# EAGLE design ACC_SensorBoard (EAGLE 7.2.0)
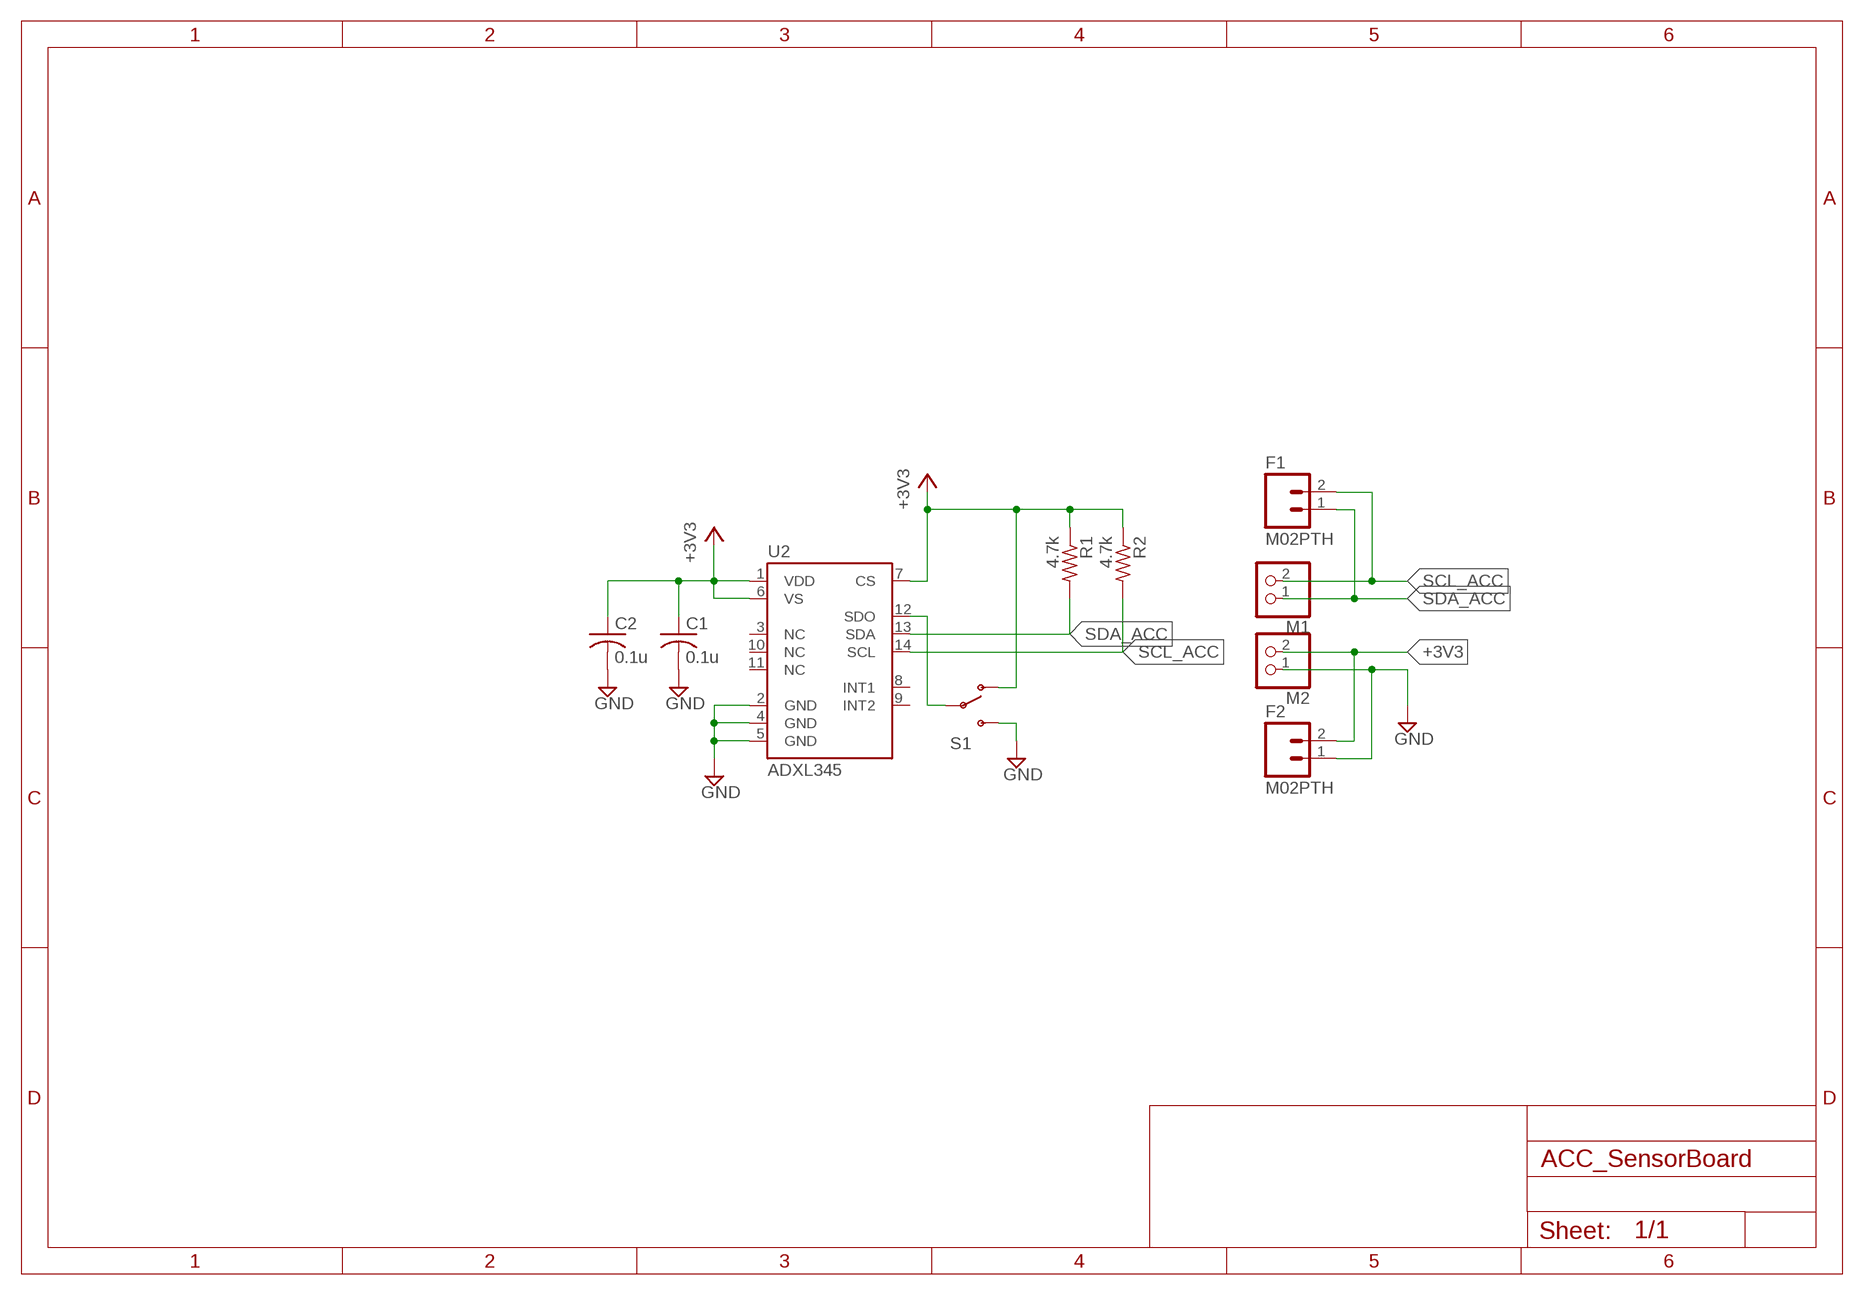
[diagram p0: schematic, sheet 1]

## Parts
C1  0.1u  C-USC0805  [C0805]
C2  0.1u  C-USC0805  [C0805]
F1  M02PTH  [1X02]
F2  M02PTH  [1X02]
M1  PINHD-1X2  [1X02]
M2  PINHD-1X2  [1X02]
R1  4.7k  R-US_R0805  [R0805]
R2  4.7k  R-US_R0805  [R0805]
S1  SWITCH-SPDTSMD  [AYZ0202]
U2  ADXL345  [LGA14]

## Nets
+3V3: C1.1 C2.1 F2.2 M2.2 R1.1 R2.1 S1.1(O) U2.1(VDD) U2.6(VS) U2.7(CS)
GND: C1.2 C2.2 F2.1 M2.1 S1.3(S) U2.2(GND) U2.4(GND) U2.5(GND)
N$1: S1.2(P) U2.12(SDO)
SCL_ACC: F1.2 M1.2 R2.2 U2.14(SCL)
SDA_ACC: F1.1 M1.1 R1.2 U2.13(SDA)
Unconnected: U2.3(NC) U2.8(INT1) U2.9(INT2) U2.10(NC) U2.11(NC)

## Library data of the parts
C1 C2 = rcl:C-US: CAPACITOR, American symbol
F1 F2 = SparkFun-Connectors:M02: Standard 2-pin 0.1" header. Use with - straight break away headers ( PRT-00116) - right angle break away headers (PRT-00553) - swiss pins (PRT-00743) - machine pins (PRT-00117) - female headers (PRT-00115) Molex polarized connector foot print use with: PRT-08233 with associated crimp pins and housings. 2.54_SCREWTERM for use with PRT-10571. 3.5mm Screw Terminal footprints for PRT-08084 5mm Screw Terminal footprints for use with PRT-08432
M1 M2 = pinhead:PINHD-1X2: PIN HEADER
R1 R2 = rcl:R-US_: RESISTOR, American symbol
S1 = SparkFun-Electromechanical:SWITCH-SPDT: SPDT Switch Simple slide switch, Spark Fun Electronics SKU : COM-00102 DPDT SMT slide switch, AYZ0202, SWCH-08179; PROD_ID: SWCH-08179
U2 = SparkFun-Sensors:ADXL345: 3-axis SPI/I2C 2/4/8/16g accelerometer

## Board
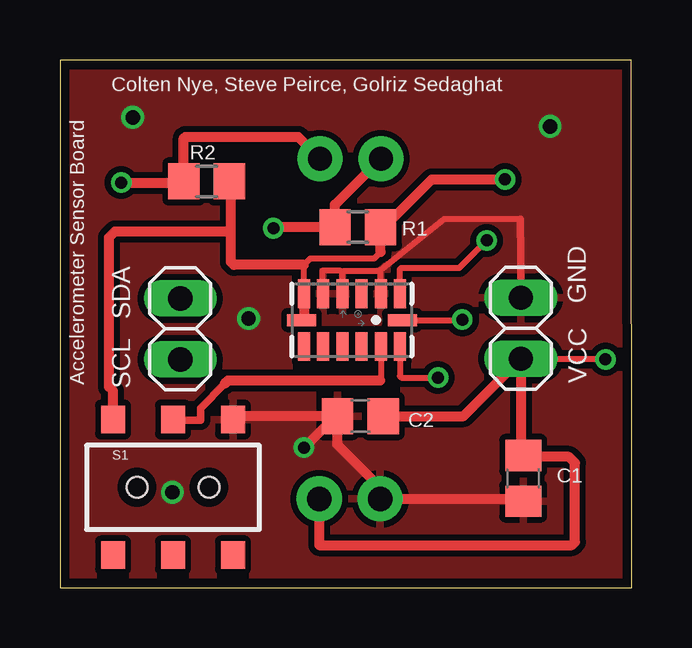
[diagram p1: board, top side]
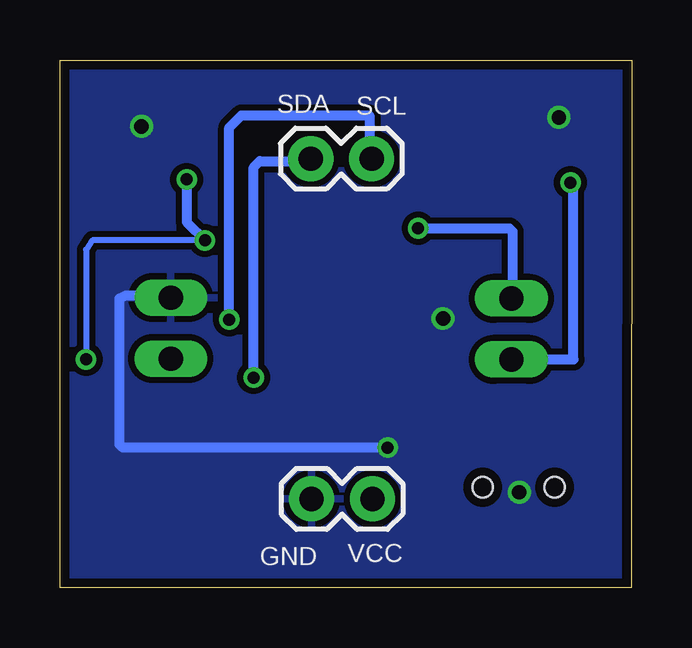
[diagram p2: board, bottom side, seen from below]

Size 23.84 x 22 mm. Coordinates in mm from the lower left corner, seen from the top.
Outline: 0.02,0 23.84,0 23.83,22 0,22 0.02,0
Copper layers (1*16): Top 0.0356mm / dielectric 1.5011mm / Bottom 0.0356mm
Design rules "oshpark-2layer": minimum track width 6mil, minimum drill 13mil, track to track 6mil, track to pad 6mil, pad to pad 6mil, via to via 6mil, smd to smd 6mil, copper to edge 15mil, drill to drill 6mil, minimum pad ring 7mil, minimum via ring 7mil, stop-mask expansion 4mil, vias tented up to drill 0mil, thermal gap 10mil

### Footprints (pad centres in the part's own frame; a part is rotated, then mirrored left to right if it is on the bottom)
C0805 = smd 1.3 x 1.5: 1 -0.95,0; 2 0.95,0
1X02 = drill 1.016 pad 1.88: 1 0,0; 2 2.54,0
1X02' = drill 1.016 long: 1 -1.27,0; 2 1.27,0
R0805 = smd 1.3 x 1.5: 1 -0.95,0; 2 0.95,0
AYZ0202 = smd 1 x 1.15: 1 -2.5,2.825; 2 0,2.825; 3 2.5,2.825; 4 -2.5,-2.825; 5 0,-2.825; 6 2.5,-2.825 | hole 0.85: 1.5,0; -1.5,0
LGA14 = smd 0.5 x 1.2: 1 2,1.1; 2 1.2,1.1; 3 0.4,1.1; 4 -0.4,1.1; 5 -1.2,1.1; 6 -2,1.1; 8 -2,-1.1; 9 -1.2,-1.1; 10 -0.4,-1.1; 11 0.4,-1.1; 12 1.2,-1.1; 13 2,-1.1 | smd 1.2 x 0.5: 7 -2.1,0; 14 2.1,0

### Placement (x,y rotation side)
C1  19.31,4.57 270 top
C2  12.53,7.16 180 top
F1  13.38,17.88 0 bottom
F2  13.35,3.71 0 bottom
M1  [1X02']  5.02,10.79 270 top
M2  [1X02']  19.22,10.82 270 top
R1  12.42,15.04 180 top
R2  6.12,16.94 180 top
S1  4.71,4.19 0 top
U2  12.18,11.16 0 top

### Tracks (layer width: path | path; a pad name or v marks a point on that pad's centre or on a via)
+3V3  (via drill 0.5 pad 0.25)
  Top 0.254: U2.6 10.18,13.46 10.43,13.72 13.1,13.72 13.37,13.99 R1.1 | U2.1 14.18,13.27 14.24,13.34 16.65,13.34 v17.8,14.48 | v22.75,9.53 19.24,9.53 M2.2
  Top 0.406: U2.6 10.18,11.26 U2.7 | 10.18,13.46 7.25,13.46 7.13,13.59 7.13,14.73 | 7.13,14.73 7.13,16.88 R2.1 | S1.1 2.21,8.21 2.05,8.38 2.05,14.61 2.3,14.86 7,14.86 7.13,14.73 | F2.2 10.81,1.78 21.35,1.78 21.48,1.91 21.48,5.21 21.22,5.46 19.37,5.46 C1.1 19.22,5.61 M2.2 16.83,7.16 C2.1 | 13.37,13.99 13.37,14.88 15.51,17.02 v18.56,17.02
  Bottom 0.254: v17.8,14.48 22.49,14.48 22.75,14.1 v22.75,9.53
  Bottom 0.406: v18.56,17.02 18.56,15.24 v17.8,14.48
GND  (via drill 0.5 pad 0.25, 0.6 pad 0.25)
  Top 0.254: U2.5 10.94,12.3 10.94,13.21 11.7,13.21 11.78,13.13 U2.4 11.78,13.16 11.83,13.21 13.35,13.21 | 13.35,13.21 13.35,12.29 U2.2 | 19.19,15.37 16.02,15.37 13.35,13.21
  Top 0.305: M2.1 19.22,13.82 19.19,15.37
  Top 0.406: C1.2 19.22,3.71 F2.1 13.35,4.19 11.57,5.97 C2.2 | C2.2 7.36,7.16 S1.3 | C2.2 11.49,7.16 v10.18,5.84
  Bottom 0.406: v10.18,5.84 21.22,5.84 21.35,5.97 21.35,12.06 21.1,12.19 19.32,12.19 M2.1
  other vias: 20.44,19.23 3.04,19.61 7.86,11.23 4.69,3.99
  pour Top (isolate 0.254): 0.02,22.1 23.89,22.1 23.89,0 0.02,0
  pour Bottom (isolate 0.254): 0.02,22.1 23.89,22.1 23.89,0 0.02,0
N$1
  Top 0.254: U2.12 13.38,8.66 13.35,8.64
  Top 0.305: 6.87,8.51 5.86,7.49 5.86,6.99 4.75,6.99 S1.2
  Top 0.406: 13.35,8.64 7,8.64 6.87,8.51
SCL_ACC  (via drill 0.5 pad 0.25)
  Top 0.254: U2.14 16.76,11.16 v16.78,11.18
  Top 0.406: F1.2 9.93,18.8 5.22,18.8 5.17,18.74 R2.2 5.12,16.89 v2.56,16.89
  Bottom 0.406: M1.2 2.43,9.53 2.43,16.76 v2.56,16.89 | v16.78,11.18 16.78,19.18 16.27,19.68 10.94,19.68 10.94,17.98 F1.2
SDA_ACC  (via drill 0.5 pad 0.25)
  Top 0.254: U2.13 14.18,8.82 14.24,8.76 v15.76,8.76
  Top 0.406: F1.1 11.47,15.97 R1.2 8.96,15.04 v8.91,14.99
  Bottom 0.406: v8.91,14.99 5.1,14.99 4.97,14.86 4.97,12.12 M1.1 | v15.76,8.76 15.76,17.53 15.51,17.78 13.49,17.78 F1.1

### Text on the board
tNames: Colten Nye, Steve Peirce, Golriz Sedaghat | GND | SDA | VCC | SCL | Accelerometer Sensor Board
bNames: SDA | SCL | VCC | GND